# Altium schematic sheet Sheet0_Top.SchDoc
size A4
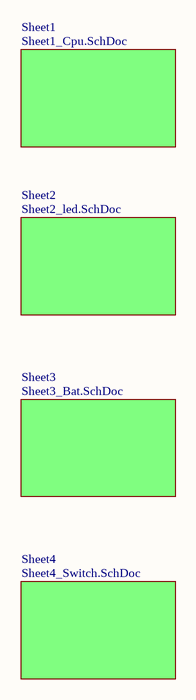
[diagram p0: Sheet0_Top.SchDoc]

## Sub-sheets
Sheet1 = Sheet1_Cpu.SchDoc: no entries
Sheet2 = Sheet2_led.SchDoc: no entries
Sheet3 = Sheet3_Bat.SchDoc: no entries
Sheet4 = Sheet4_Switch.SchDoc: no entries